# Altium schematic sheet CH1.SchDoc
size C
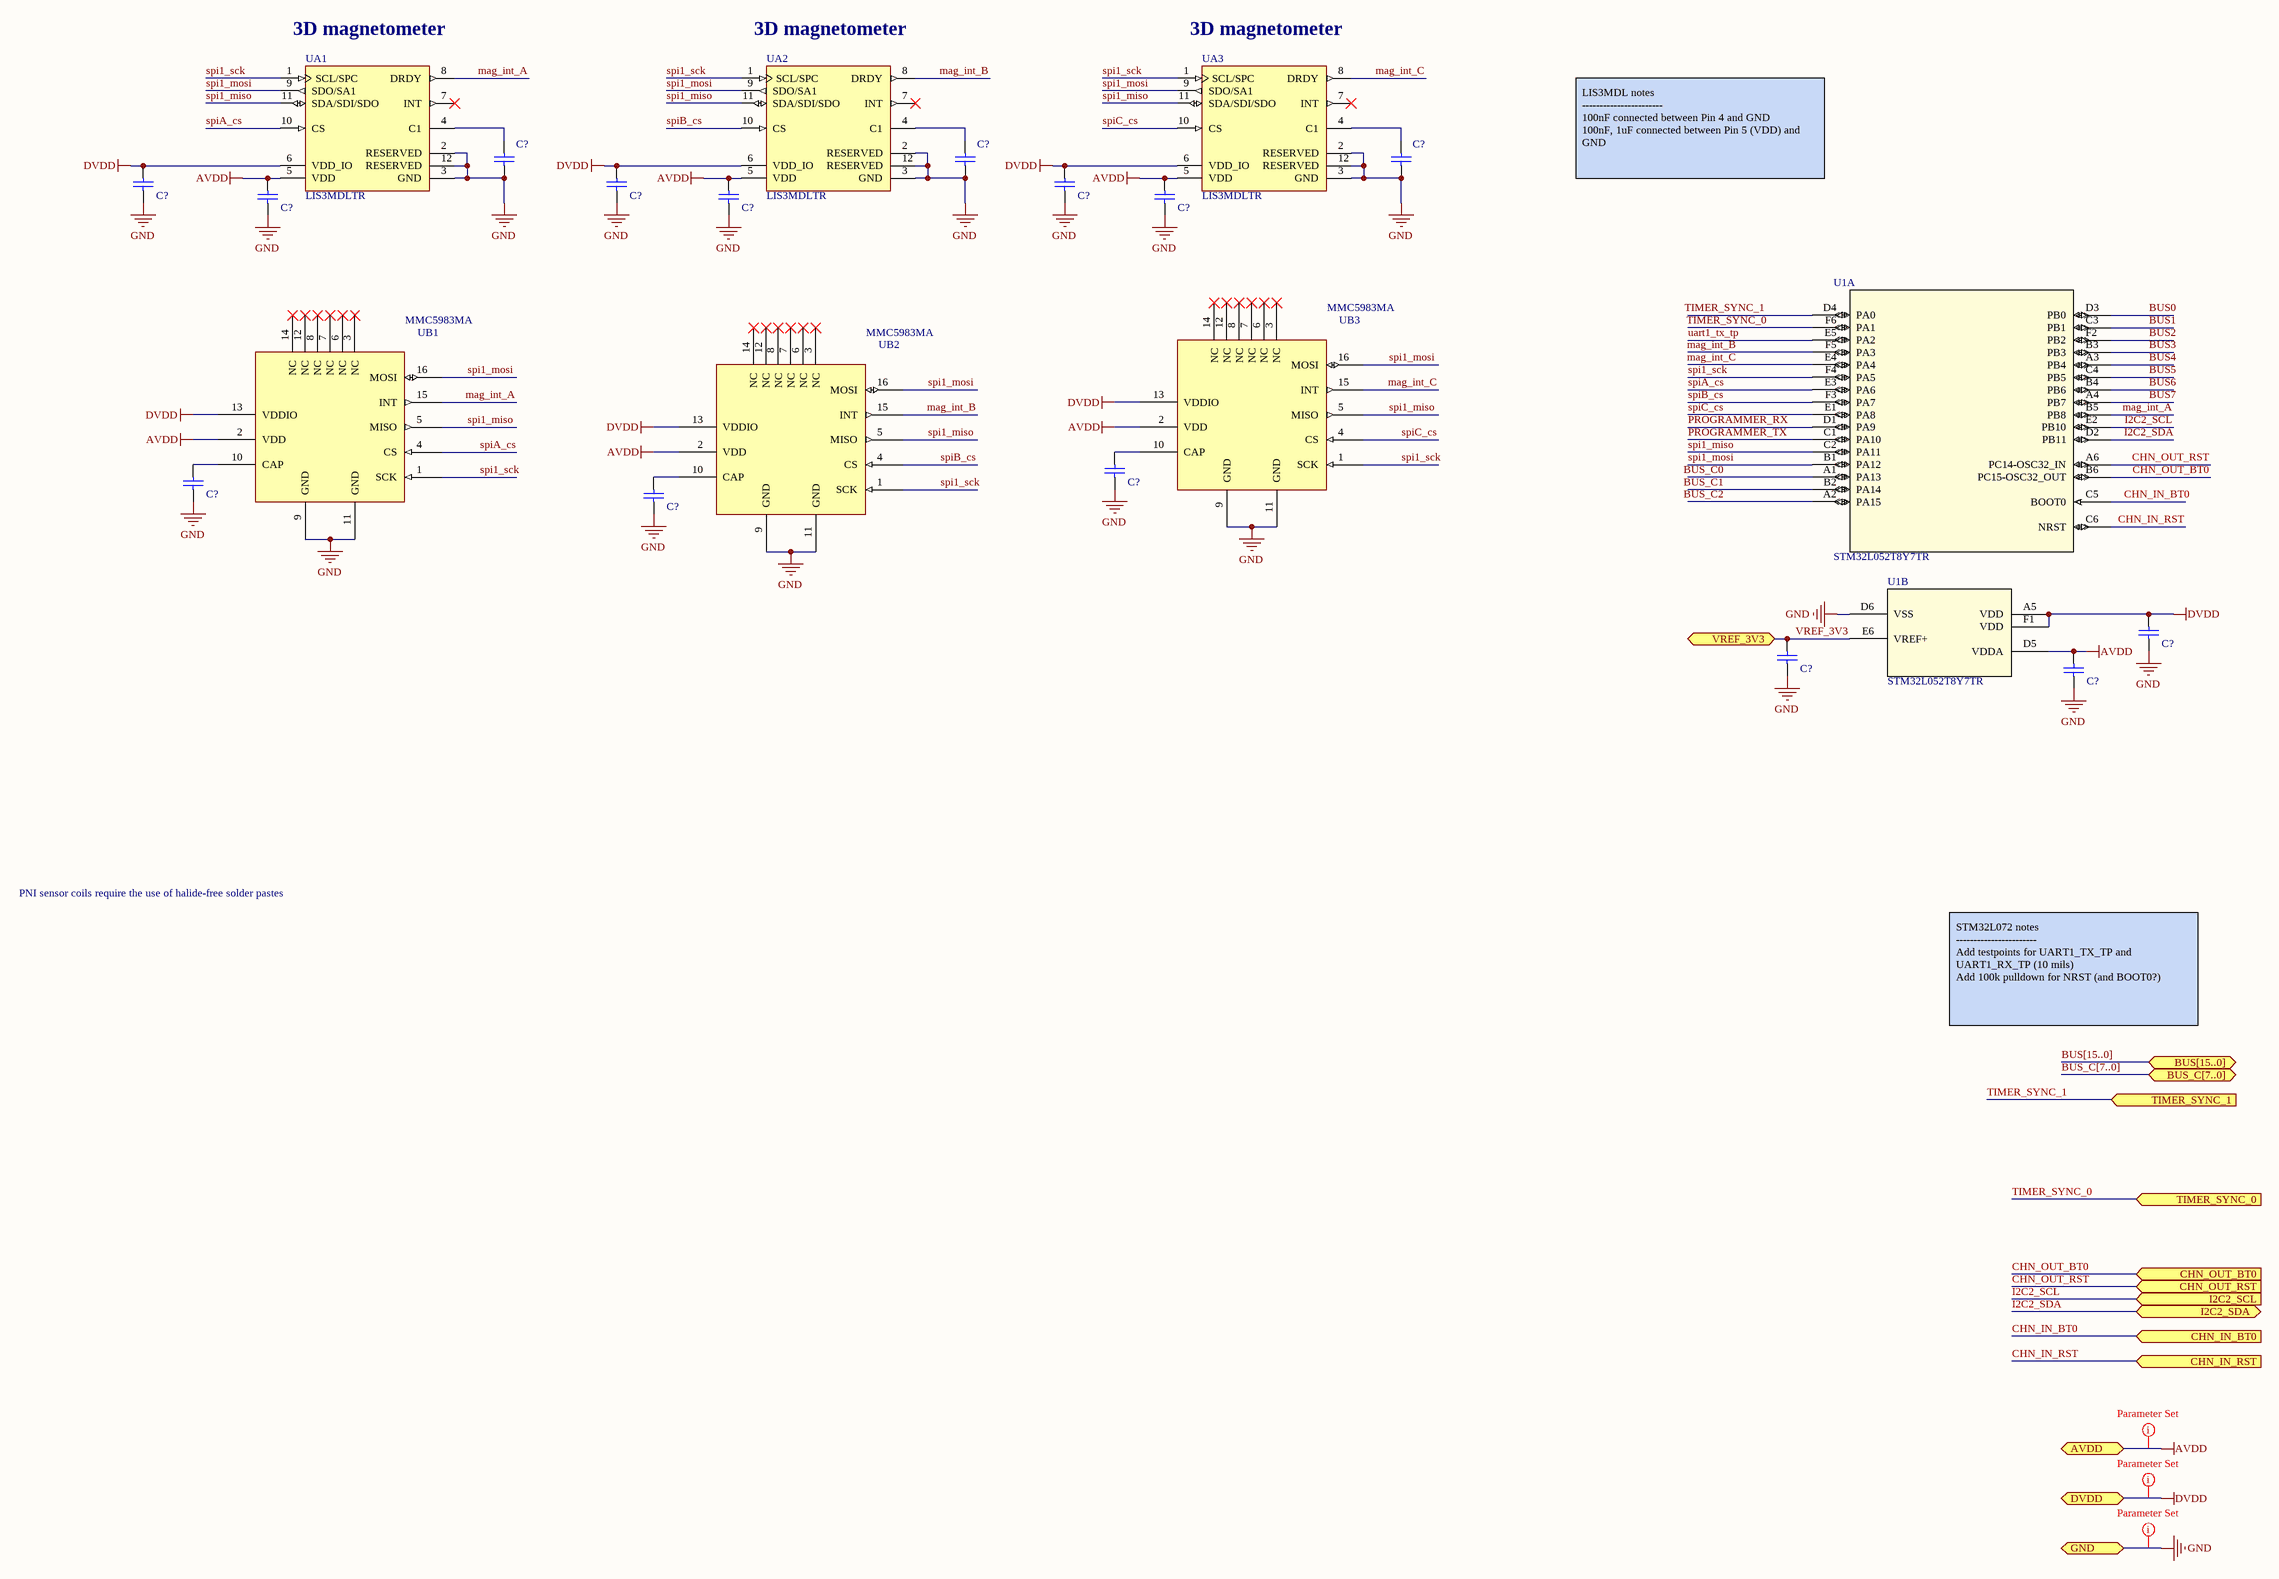
[diagram p0: CH1.SchDoc]

## Parts
(Parts that share a designator on the sheet are numbered #1, #2 ... from top to bottom, then left to right.)
C?#1  GRM155R71C104KA88D  [CAPC1005X55X25NL05T10]  (value not drawn)
C?#2  GRM155R71C104KA88D  [CAPC1005X55X25NL05T10]  (value not drawn)
C?#3  GRM155R71C104KA88D  [CAPC1005X55X25NL05T10]  (value not drawn)
C?#4  GRM155R71C104KA88D  [CAPC1005X55X25NL05T10]  (value not drawn)
C?#5  GRM155R71C104KA88D  [CAPC1005X55X25NL05T10]  (value not drawn)
C?#6  GRM155R71C104KA88D  [CAPC1005X55X25NL05T10]  (value not drawn)
C?#7  GRM155R71C104KA88D  [CAPC1005X55X25NL05T10]  (value not drawn)
C?#8  GRM155R71C104KA88D  [CAPC1005X55X25NL05T10]  (value not drawn)
C?#9  GRM155R71C104KA88D  [CAPC1005X55X25NL05T10]  (value not drawn)
C?#10  GRM155R71C104KA88D  [CAPC1005X55X25NL05T10]  (value not drawn)
C?#11  GRM155R71C104KA88D  [CAPC1005X55X25NL05T10]  (value not drawn)
C?#12  GRM155R71C104KA88D  [CAPC1005X55X25NL05T10]  (value not drawn)
C?#13  GRM155R71C104KA88D  [CAPC1005X55X25NL05T10]  (value not drawn)
C?#14  GRM155R71C104KA88D  [CAPC1005X55X25NL05T10]  (value not drawn)
C?#15  GRM155R71C104KA88D  [CAPC1005X55X25NL05T10]  (value not drawn)
MMC5983MA#1  UB3
MMC5983MA#2  UB1
MMC5983MA#3  UB2
U1  STM32L052T8Y7TR  [WLCSP36L_DIE417]  (parts A,B of 2)
UA1  LIS3MDLTR  [STM-LGA-12]
UA2  LIS3MDLTR  [STM-LGA-12]
UA3  LIS3MDLTR  [STM-LGA-12]

## Ports
AVDD (bidir), BUS[15..0] (bidir), BUS_C[7..0] (bidir), CHN_IN_BT0 (in), CHN_IN_RST (in), CHN_OUT_BT0 (in), CHN_OUT_RST (in), DVDD (bidir), GND (bidir), I2C2_SCL (in), I2C2_SDA (bidir), TIMER_SYNC_0 (in), TIMER_SYNC_1 (in), VREF_3V3 (bidir)

## Nets
AVDD: C?#7.2 C?#8.2 C?#9.2 C?#15.2 MMC5983MA#1.2(VDD) MMC5983MA#2.2(VDD) MMC5983MA#3.2(VDD) U1.D5(VDDA) UA1.5(VDD) UA2.5(VDD) UA3.5(VDD) ; port AVDD
DVDD: C?#4.2 C?#5.2 C?#6.2 C?#13.2 MMC5983MA#1.13(VDDIO) MMC5983MA#2.13(VDDIO) MMC5983MA#3.13(VDDIO) U1.A5(VDD) U1.F1(VDD) UA1.6(VDD_IO) UA2.6(VDD_IO) UA3.6(VDD_IO) ; port DVDD
GND: C?#1.1 C?#2.1 C?#3.1 C?#4.1 C?#5.1 C?#6.1 C?#7.1 C?#8.1 C?#9.1 C?#10.1 C?#11.1 C?#12.1 C?#13.1 C?#14.1 C?#15.1 MMC5983MA#1.9(GND) MMC5983MA#1.11(GND) MMC5983MA#2.9(GND) MMC5983MA#2.11(GND) MMC5983MA#3.9(GND) MMC5983MA#3.11(GND) U1.D6(VSS) UA1.2(RESERVED) UA1.3(GND) UA1.12(RESERVED) UA2.2(RESERVED) UA2.3(GND) UA2.12(RESERVED) UA3.2(RESERVED) UA3.3(GND) UA3.12(RESERVED) ; port GND
BUS0: U1.D3(PB0)
BUS1: U1.C3(PB1)
BUS2: U1.F2(PB2)
BUS3: U1.B3(PB3)
BUS4: U1.A3(PB4)
BUS5: U1.C4(PB5)
BUS6: U1.B4(PB6)
BUS7: U1.A4(PB7)
BUS_C0: U1.A1(PA13)
BUS_C1: U1.B2(PA14)
BUS_C2: U1.A2(PA15)
CHN_IN_BT0: U1.C5(BOOT0) ; port CHN_IN_BT0
CHN_IN_RST: U1.C6(NRST) ; port CHN_IN_RST
CHN_OUT_BT0: U1.B6(PC15-OSC32_OUT) ; port CHN_OUT_BT0
CHN_OUT_RST: U1.A6(PC14-OSC32_IN) ; port CHN_OUT_RST
I2C2_SCL: U1.E2(PB10) ; port I2C2_SCL
I2C2_SDA: U1.D2(PB11) ; port I2C2_SDA
mag_int_A: MMC5983MA#2.15(INT) U1.B5(PB8) UA1.8(DRDY)
mag_int_B: MMC5983MA#3.15(INT) U1.F5(PA3) UA2.8(DRDY)
mag_int_C: MMC5983MA#1.15(INT) U1.E4(PA4) UA3.8(DRDY)
PROGRAMMER_RX: U1.D1(PA9)
PROGRAMMER_TX: U1.C1(PA10)
spi1_miso: MMC5983MA#1.5(MISO) MMC5983MA#2.5(MISO) MMC5983MA#3.5(MISO) U1.C2(PA11) UA1.11(SDA/SDI/SDO) UA2.11(SDA/SDI/SDO) UA3.11(SDA/SDI/SDO)
spi1_mosi: MMC5983MA#1.16(MOSI) MMC5983MA#2.16(MOSI) MMC5983MA#3.16(MOSI) U1.B1(PA12) UA1.9(SDO/SA1) UA2.9(SDO/SA1) UA3.9(SDO/SA1)
spi1_sck: MMC5983MA#1.1(SCK) MMC5983MA#2.1(SCK) MMC5983MA#3.1(SCK) U1.F4(PA5) UA1.1(SCL/SPC) UA2.1(SCL/SPC) UA3.1(SCL/SPC)
spiA_cs: MMC5983MA#2.4(CS) U1.E3(PA6) UA1.10(CS)
spiB_cs: MMC5983MA#3.4(CS) U1.F3(PA7) UA2.10(CS)
spiC_cs: MMC5983MA#1.4(CS) U1.E1(PA8) UA3.10(CS)
TIMER_SYNC_0: U1.F6(PA1) ; port TIMER_SYNC_0
TIMER_SYNC_1: U1.D4(PA0) ; port TIMER_SYNC_1
uart1_tx_tp: U1.E5(PA2)
VREF_3V3: C?#14.2 U1.E6(VREF+) ; port VREF_3V3
NetC?#1_2: C?#1.2 UA1.4(C1)
NetC?#2_2: C?#2.2 UA2.4(C1)
NetC?#3_2: C?#3.2 UA3.4(C1)
NetC?#10_2: C?#10.2 MMC5983MA#1.10(CAP)
NetC?#11_2: C?#11.2 MMC5983MA#2.10(CAP)
NetC?#12_2: C?#12.2 MMC5983MA#3.10(CAP)

Not connected (* = marked no-connect by the designer): MMC5983MA#1 3(NC)* 6(NC)* 7(NC)* 8(NC)* 12(NC)* 14(NC)*; MMC5983MA#2 3(NC)* 6(NC)* 7(NC)* 8(NC)* 12(NC)* 14(NC)*; MMC5983MA#3 3(NC)* 6(NC)* 7(NC)* 8(NC)* 12(NC)* 14(NC)*; UA1 7(INT)*; UA2 7(INT)*; UA3 7(INT)*

## Buses and harness runs
bus BUS[15..0] = port BUS[15..0]
bus BUS_C[7..0] = port BUS_C[7..0]

## Layout directives
net class Power: AVDD, DVDD, GND

## Notes on the sheet
- (near UA1) 3D magnetometer
- (near UA2) 3D magnetometer
- (near UA3) 3D magnetometer
- LIS3MDL notes
  -----------------------
  100nF connected between Pin 4 and GND
  100nF, 1uF connected between Pin 5 (VDD) and GND
- PNI sensor coils require the use of halide-free solder pastes
- STM32L072 notes
  -----------------------
  Add testpoints for UART1_TX_TP and UART1_RX_TP (10 mils)
  Add 100k pulldown for NRST (and BOOT0?)

## Library data of the parts
C?#1-C?#3 = CMP-2100-03641-1: Chip Capacitor, 0.1 uF, +/- 10%, 16 V, -55 to 125 degC, 0402 (1005 Metric), RoHS, Tape and Reel; Manufacturer: Murata; Material: Ceramic; Insulation Resistance: 10GR; Voltage: 16V; Dielectric: X7R; Capacitance: 100nF; REACH SVHC: NoSVHC; Depth: 0.5mm; Case/Package: 0402; Datasheet URL: http://psearch.en.murata.com/capacitor/product/GRM155R71C104KA88%23.pdf; Lead Free: LeadFree; Dielectric Material: Ceramic; Manufacturer URL: http://www.murata.com/; Min Operating Temperature: -55degC; Length: 1mm; Case Code (Metric): 1005; Radiation Hardening: No; Package Reference: 0402; RoHSCompliant: true; Datasheet Version: 42675.0; Thickness: 0.022inch; Packaging: TapeandReel; Voltage Rating (DC): 16V; Tolerance: 10%; Max Operating Temperature: 125degC; Package Description: 2-Pin Surface Mount Device, Body 1 x 0.5 mm; Mount: SurfaceMount; Height: 0.5mm; Width: 0.5mm; Number of Pins: 2; Voltage Rating: 16V; Case Code (Imperial): 0402; Termination: SMD/SMT; Package Quantity: 1
C?#4-C?#15 = CMP-2100-03641-1: Chip Capacitor, 10 uF, +/- 10%, 6 V, -55 to 125 degC, 0402 (1005 Metric), RoHS, Tape and Reel; Manufacturer: Murata; Material: Ceramic; Insulation Resistance: 10GR; Voltage: 16V; Dielectric: X7R; Capacitance: 100nF; REACH SVHC: NoSVHC; Depth: 0.5mm; Case/Package: 0402; Datasheet URL: http://psearch.en.murata.com/capacitor/product/GRM155R71C104KA88%23.pdf; Lead Free: LeadFree; Dielectric Material: Ceramic; Manufacturer URL: http://www.murata.com/; Min Operating Temperature: -55degC; Length: 1mm; Case Code (Metric): 1005; Radiation Hardening: No; Package Reference: 0402; RoHSCompliant: true; Datasheet Version: 42675.0; Thickness: 0.022inch; Packaging: TapeandReel; Voltage Rating (DC): 16V; Tolerance: 10%; Max Operating Temperature: 125degC; Package Description: 2-Pin Surface Mount Device, Body 1 x 0.5 mm; Mount: SurfaceMount; Height: 0.5mm; Width: 0.5mm; Number of Pins: 2; Voltage Rating: 16V; Case Code (Imperial): 0402; Termination: SMD/SMT; Package Quantity: 1
MMC5983MA#1-MMC5983MA#3 = U: MMC5983MA 3-axis magnetic sensor
U1 = STM32L052T8Y7TR: No Description Available; Vendor: STMicroelectronics; Built_By: EMA_UL_Team; SourceLibrary: STMicroelectronics_2020-10-07; Manufacturer_Part_Number: STM32L052T8Y7TR; Copyright: Copyright (C) 2018 Accelerated Designs. All rights reserved; RefDes: RefDes; Type: DEV
UA1-UA3 = CMP-2000-07463-1: Digital Output Magnetic Sensor: Ultra-Low-Power, High-Performance 3-Axis Magnetometer, 1.9 to 3.6 V, -40 to 85 degC, 12-Pin LGA, RoHS, Tape and Reel; Manufacturer: STMicroelectronics; Max Supply Current: 270uA; Case\/Package: Module; Min Supply Voltage: 1.9V; Max Supply Voltage: 3.6V; Resolution: 16b; RoHSCompliant: true; Datasheet Version: Rev. 6, 05/2017; REACH SVHC: NoSVHC; Lead Free: LeadFree; Package Quantity: 8000; Package Description: 12-Pin Land Grid Array Package, Body 2 x 2 mm, Pitch 0.5 mm; Package Reference: LGA-12; Packaging: TapeandReel; Min Operating Temperature: -40degC; Mount: SurfaceMount; Contact Plating: Gold; Datasheet URL: http://www.st.com/content/ccc/resource/technical/document/datasheet/54/2a/85/76/e3/97/42/18/DM00075867.pdf/files/DM00075867.pdf/jcr:content/translations/en.DM00075867.pdf; Mounting Technology: SurfaceMount; Radiation Hardening: No; Number of Pins: 12; Max Operating Temperature: 85degC; Manufacturer URL: http://www.st.com/